# EAGLE design Blinky_Board (EAGLE 6.3)
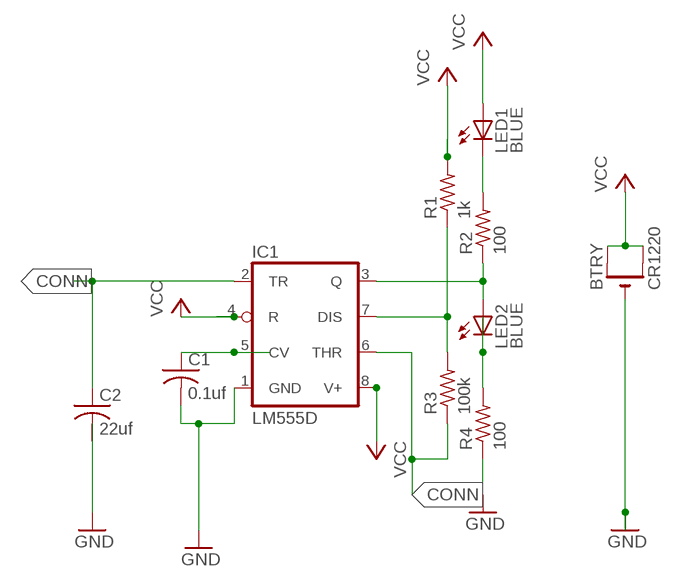
[diagram p0: schematic, sheet 1]

## Parts
BTRY  CR1220  CR1220SMT  [CR1220-SMD]
C1  0.1uf  C-USC0805  [C0805]
C2  22uf  C-USC0805  [C0805]
IC1  LM555D  [SO08]
LED1  BLUE  LEDCHIPLED_0805  [CHIPLED_0805]
LED2  BLUE  LEDCHIPLED_0805  [CHIPLED_0805]
R1  1k  R-US_R0805  [R0805]
R2  100  R-US_R0805  [R0805]
R3  100k  R-US_R0805  [R0805]
R4  100  R-US_R0805  [R0805]

## Nets
CONN: C2.1 IC1.2(TR) IC1.6(THR) R3.1
GND: C1.2 C2.2 IC1.1(GND) R4.1
N$1: LED1.C R2.2
N$2: IC1.3(Q) LED2.A R2.1
N$3: LED2.C R4.2
N$5: IC1.7(DIS) R1.1 R3.2
N$10: C1.1 IC1.5(CV)
VCC: BTRY.+$1(+) BTRY.+$2(+1) IC1.4(R) IC1.8(V+) LED1.A R1.2
Unconnected: BTRY.-

## Library data of the parts
BTRY = adafruit:CR1220: CR1216/CR1220/CR1225 12mm 3V lithium coin cell Great for battery packup. Both SMT and THM holders. Note the THM package has the ground pads on both sides of the PCB so that the masks are the same - this reduces the cost; OC_NEWARK: unknown
C1 = adafruit:C-US: CAPACITOR, American symbol; MPN: C0805X104J5RAC3316; OC_NEWARK: 01AC1592
C2 = adafruit:C-US: CAPACITOR, American symbol; MPN: B32529C0224K000; OC_NEWARK: 21C0562
IC1 = adafruit:*555: TIMER Changed DIP package to have round (not oval) pin pads http://www.ladyada.net/library/pcb/eaglelibrary.html; MPN: NE555DR; OC_NEWARK: 05M4240
LED1 LED2 = adafruit:LED: LED OSRAM: - CHIPLED LG R971, LG N971, LY N971, LG Q971, LY Q971, LO R971, LY R971 LH N974, LH R974 LS Q976, LO Q976, LY Q976 LO Q996 - Hyper CHIPLED LW Q18S LB Q993, LB Q99A, LB R99A - SideLED LS A670, LO A670, LY A670, LG A670, LP A670 LB A673, LV A673, LT A673, LW A673 LH A674 LY A675 LS A676, LA A676, LO A676, LY A676, LW A676 LS A679, LY A679, LG A679 - Hyper Micro SIDELED® LS Y876, LA Y876, LO Y876, LY Y876 LT Y87S - SmartLED LW L88C, LW L88S LB L89C, LB L89S, LG L890 LS L89K, LO L89K, LY L89K LS L896, LA L896, LO L896, LY L896 - TOPLED LS T670, LO T670, LY T670, LG T670, LP T670 LSG T670, LSP T670, LSY T670, LOP T670, LYG T670 LG T671, LOG T671, LSG T671 LB T673, LV T673, LT T673, LW T673 LH T674 LS T676, LA T676, LO T676, LY T676, LB T676, LH T676, LSB T676, LW T676 LB T67C, LV T67C, LT T67C, LS T67K, LO T67K, LY T67K, LW E67C LS E67B, LA E67B, LO E67B, LY E67B, LB E67C, LV E67C, LT E67C LW T67C LS T679, LY T679, LG T679 LS T770, LO T770, LY T770, LG T770, LP T770 LB T773, LV T773, LT T773, LW T773 LH T774 LS E675, LA E675, LY E675, LS T675 LS T776, LA T776, LO T776, LY T776, LB T776 LHGB T686 LT T68C, LB T68C - Hyper Mini TOPLED® LB M676 - Mini TOPLED Santana® LG M470 LS M47K, LO M47K, LY M47K Source: http://www.osram.convergy.de/; MPN: MCL-S270SBLC; OC_NEWARK: 14N9357
R1 = adafruit:R-US_: RESISTOR, American symbol; MF: VISHAY/DALE; MPN: CRCW08051K00FKTA; OC_NEWARK: 05F1507
R2 R4 = adafruit:R-US_: RESISTOR, American symbol; MPN: ERJ-3EKF97R6V; OC_NEWARK: 90W3235
R3 = adafruit:R-US_: RESISTOR, American symbol; MF: VISHAY/DALE; MPN: CRCW0603100KFKEA; OC_NEWARK: 42K3667

## Net classes
0 default: width 0.305 mm, drill 0.508 mm, clearance 0.381 mm

## Board
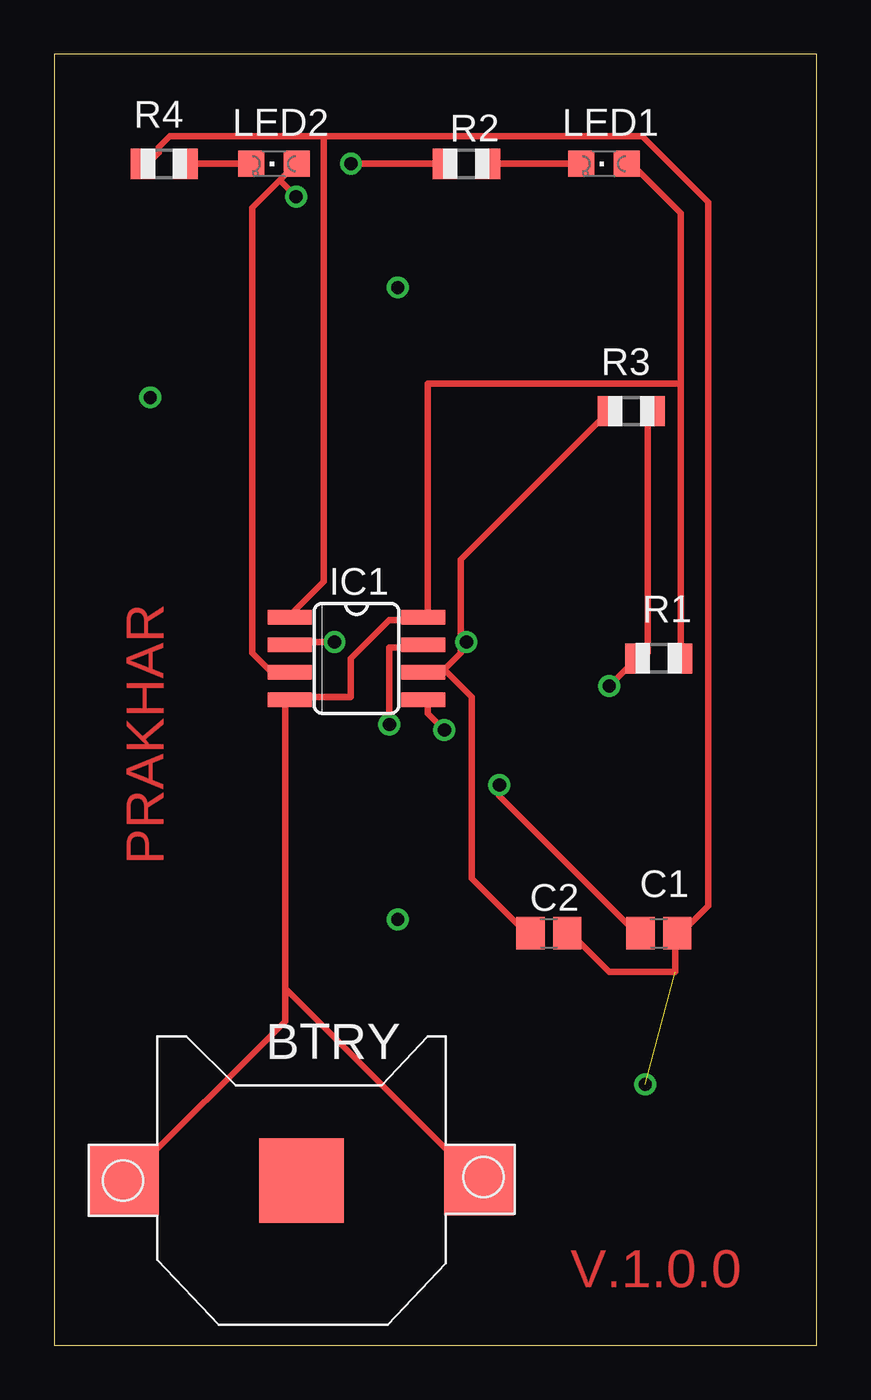
[diagram p1: board, top side]
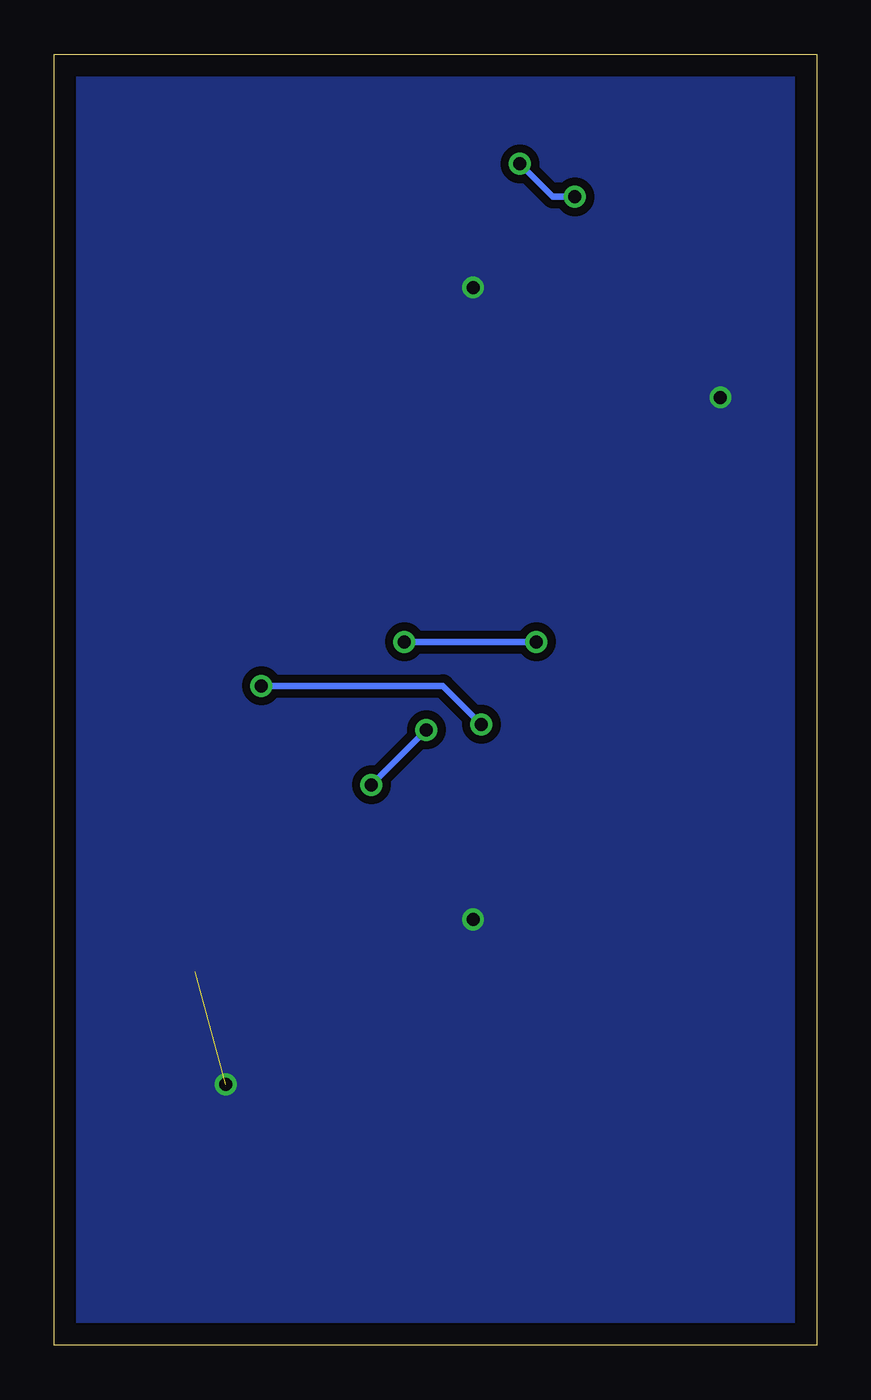
[diagram p2: board, bottom side, seen from below]

Size 35.23 x 59.68 mm. Coordinates in mm from the lower left corner, seen from the top.
Outline: 0,0 35.23,0 35.23,59.68 0,59.68 0,0
Copper layers (1*16): Top 0.035mm / dielectric 1.5mm / Bottom 0.035mm
Design rules "default *": minimum track width 10mil, minimum drill 20mil, track to track 8mil, track to pad 8mil, pad to pad 8mil, via to via 8mil, smd to smd 8mil, copper to edge 40mil, drill to drill 8mil, minimum pad ring 10mil, minimum via ring 8mil, stop-mask expansion 4mil, vias tented up to drill 0mil, thermal gap 10mil

### Footprints (pad centres in the part's own frame; a part is rotated, then mirrored left to right if it is on the bottom)
CR1220-SMD = smd 3.2 x 3.2: +$1 -8.2,0; +$2 8.2,0 | smd 3.9 x 3.9: - 0,0
C0805 = smd 1.3 x 1.5: 1 -0.85,0; 2 0.85,0
SO08 = smd 0.66 x 2.032: 1 -1.905,-3.073; 2 -0.635,-3.073; 3 0.635,-3.073; 4 1.905,-3.073; 5 1.905,3.073; 6 0.635,3.073; 7 -0.635,3.073; 8 -1.905,3.073
CHIPLED_0805 = smd 1.2 x 1.2: A 0,-1.05; C 0,1.05
R0805 = smd 1.1 x 1.4: 1 -1,0; 2 1,0

### Placement (x,y rotation side)
BTRY  11.43,7.62 0 top
C1  27.94,19.05 0 top
C2  22.86,19.05 0 top
IC1  13.97,31.75 270 top
LED1  25.4,54.61 90 top
LED2  10.16,54.61 90 top
R1  27.94,31.75 0 top
R2  19.05,54.61 0 top
R3  26.67,43.18 0 top
R4  5.08,54.61 0 top

### Tracks (layer width: path | path; a pad name or v marks a point on that pad's centre or on a via)
CONN  (via drill 0.61)
  Top 0.305: 18.8,32.51 18.8,32 18.03,31.24 | 18.8,32.51 18.8,36.32 25.65,43.18 R3.1 | 18.03,31.24 17.27,31.24 IC1.6 18.03,31.24 | 18.03,31.24 19.3,29.97 19.3,21.59 21.84,19.05 C2.1 | v12.95,32.51 10.92,32.51 IC1.2 | 18.8,32.51 v19.05,32.51
  Bottom 0.305: v19.05,32.51 v12.95,32.51
GND  (via drill 0.6)  (1 unrouted)
  Top 0.305: C2.2 23.88,19.05 25.65,17.27 28.7,17.27 28.7,19.05 C1.2 28.96,19.05 30.23,20.32 30.23,52.83 27.18,55.88 12.45,55.88 | 12.45,55.88 5.33,55.88 4.83,55.37 4.83,55.12 4.32,54.61 R4.1 | 12.45,55.88 12.45,35.31 10.92,33.78 IC1.1
  other vias: 4.45,43.81 15.88,48.9 15.88,19.68 27.3,12.06
  pour Bottom: -1.27,60.96 -1.27,-1.27 36.83,-1.27 36.83,60.96
  pour Bottom: -1.27,60.33 -0.64,60.33 -0.64,-0.64 36.2,-0.64 36.2,0 36.2,60.96 -1.27,60.96
N$1
  Top 0.305: R2.2 LED1.C
N$2  (via drill 0.61)
  Top 0.305: 10.41,53.85 9.14,52.58 9.14,32 9.91,31.24 10.67,31.24 IC1.3 | 10.41,53.85 11.18,54.61 LED2.A | v13.72,54.61 R2.1 | 10.41,53.85 v11.18,53.09
  Bottom 0.305: v13.72,54.61 12.19,53.09 v11.18,53.09
N$3
  Top 0.305: R4.2 LED2.C
N$5  (via drill 0.61)
  Top 0.305: R3.2 27.43,43.18 27.43,32 27.18,31.75 R1.1 26.92,31.75 v25.65,30.48 | v15.49,28.7 15.49,32.26 17.02,32.26 IC1.7
  Bottom 0.305: v15.49,28.7 17.27,30.48 v25.65,30.48
N$10  (via drill 0.61)
  Top 0.305: v20.57,25.91 20.57,25.4 26.92,19.05 C1.1 | v18.03,28.45 17.27,29.21 17.27,29.72 IC1.5
  Bottom 0.305: v18.03,28.45 v20.57,25.91
VCC
  Top 0.305: 28.96,44.45 28.96,31.75 R1.2 | 28.96,44.45 28.96,52.32 26.67,54.61 LED1.A | 10.67,16.51 10.67,29.72 IC1.4 10.92,29.97 13.72,29.97 13.72,31.75 15.49,33.53 17.02,33.53 IC1.8 17.27,33.78 17.27,44.45 28.96,44.45 | 10.67,16.51 10.67,14.99 3.3,7.62 BTRY.+$1 | 10.67,16.51 19.56,7.62 BTRY.+$2

### Text on the board
Top: PRAKHAR | V.1.0.0